# EasyEDA Pro project uP_Prelab.eprj

# Schematic Week1
Board Name: Board1; Create Date: 2025-12-17; Page Name: P1; Project Name: uP_Prelab; Schematic Name: Schematic1; Update Date: 2025-12-17; Company: EasyEDA.com; Page Size: A4; Version: V1.0
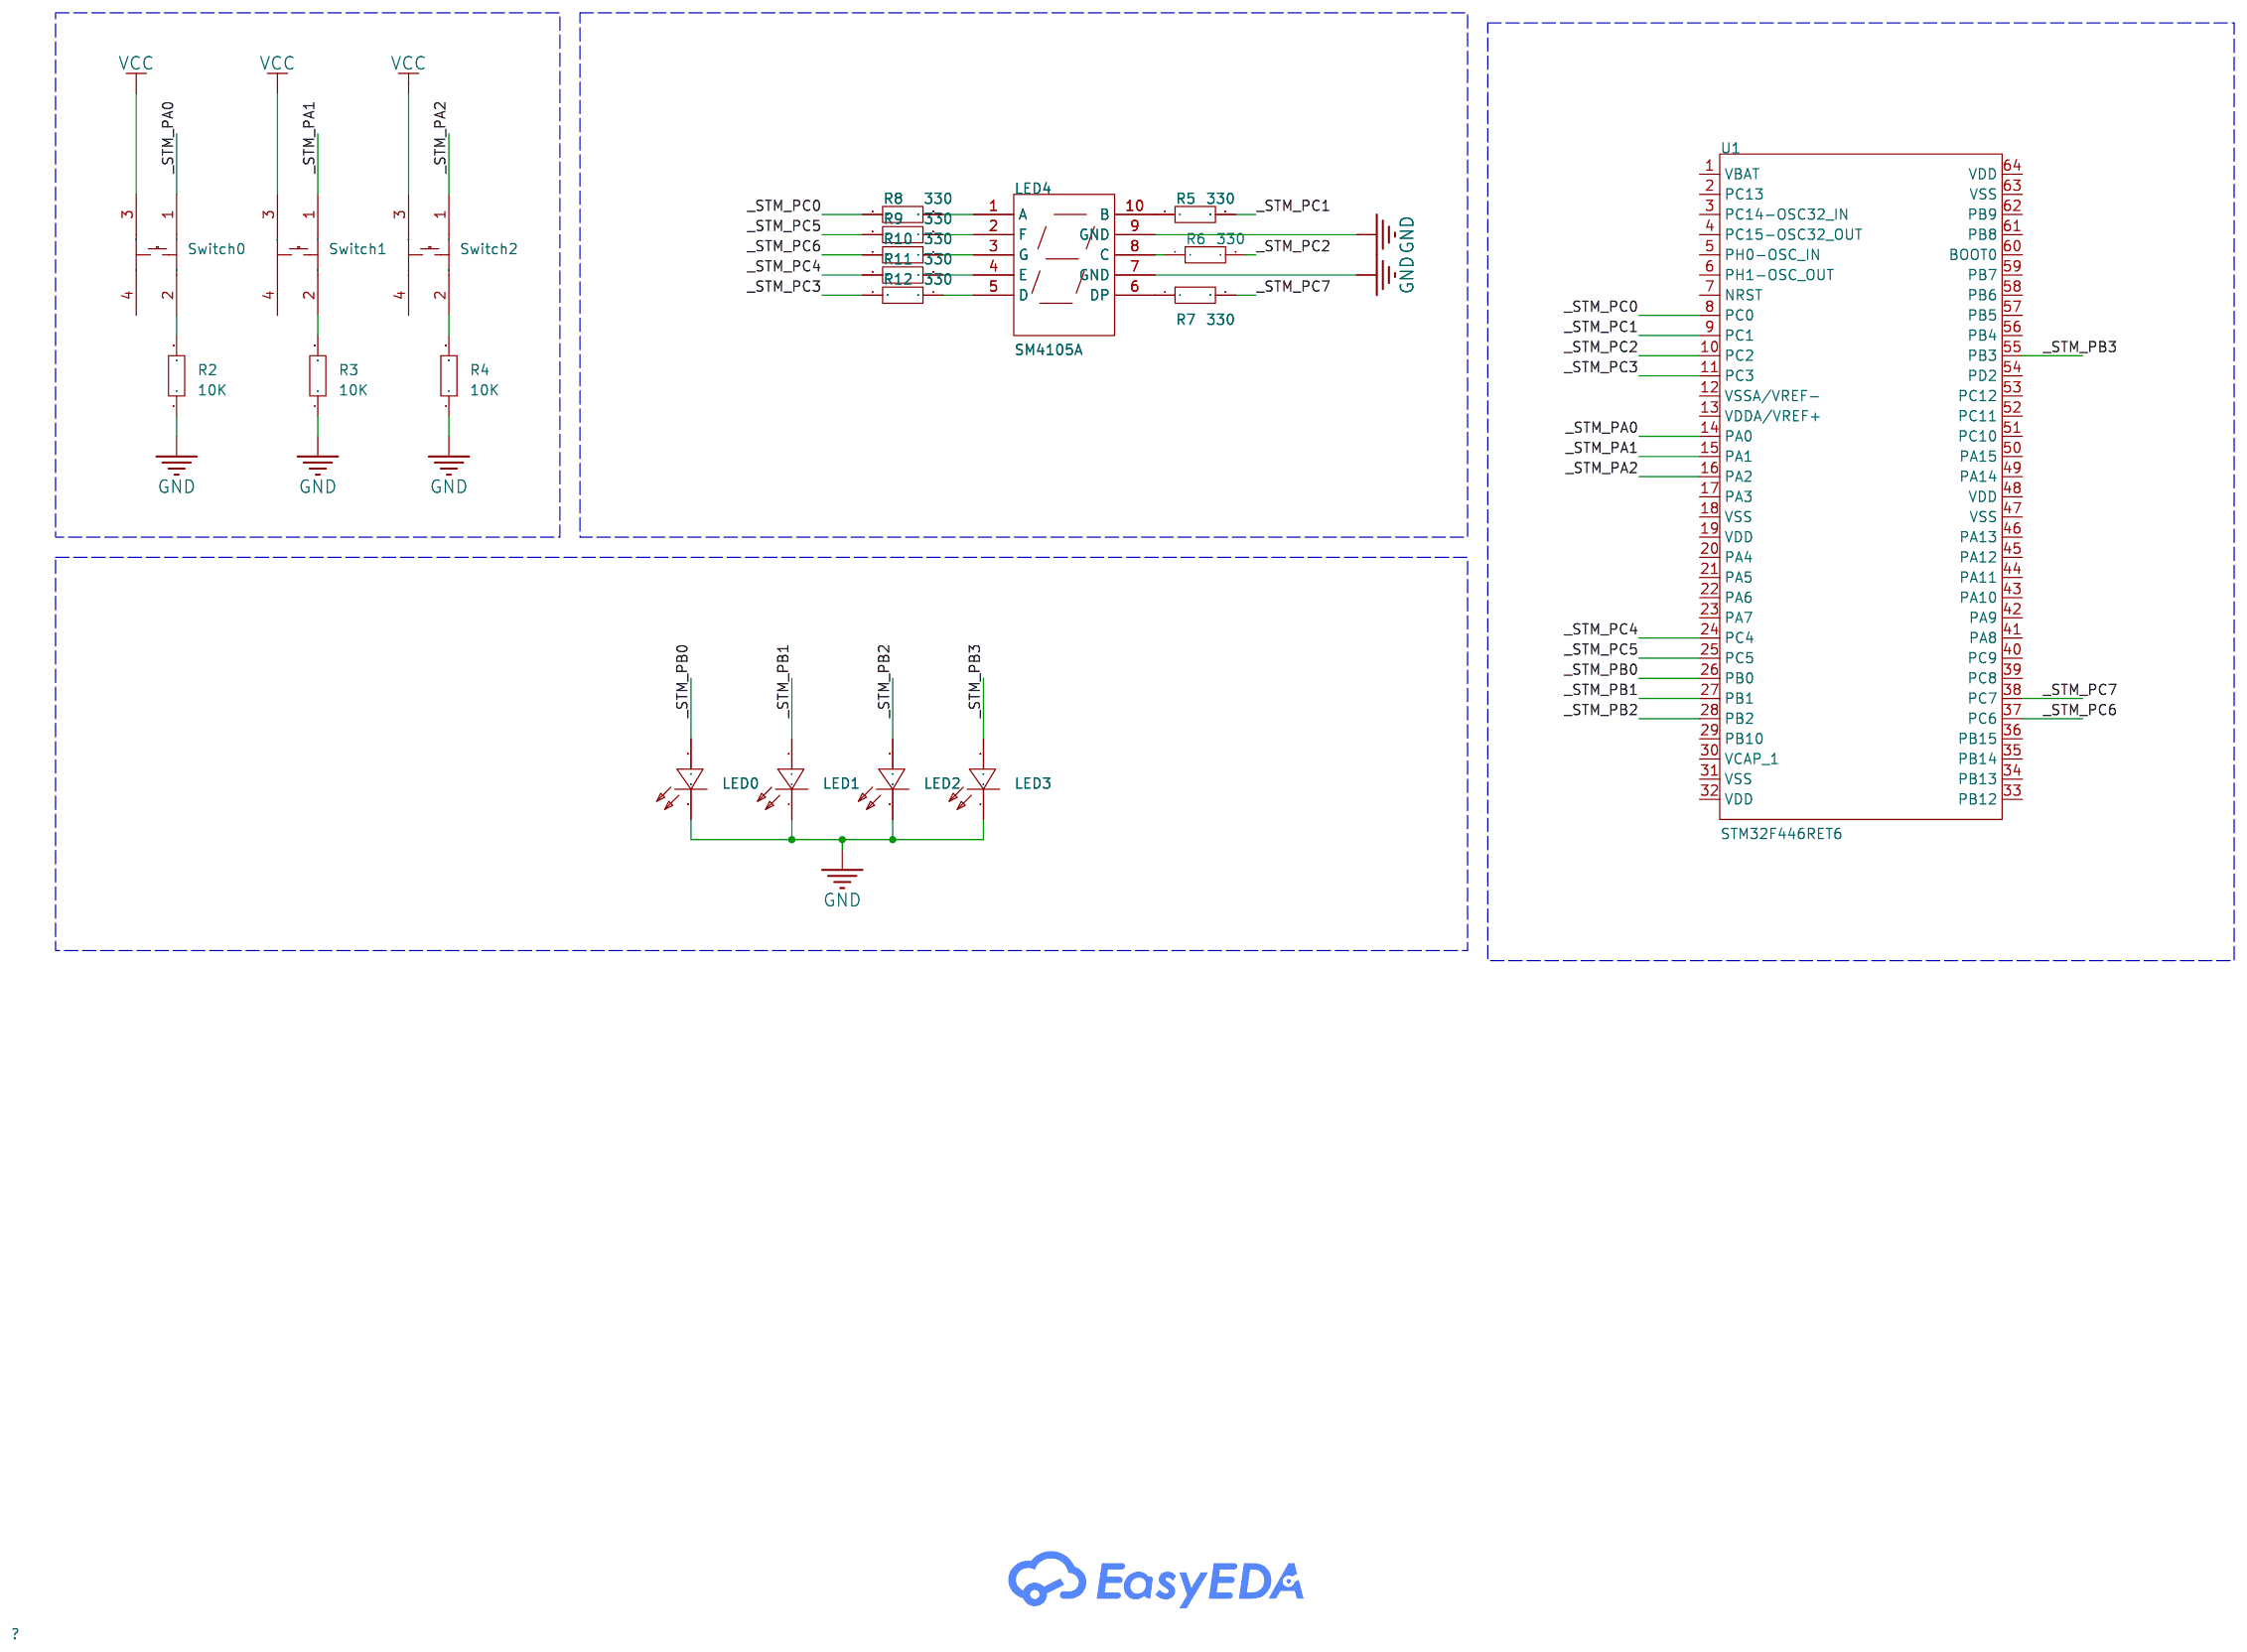
[diagram p0: schematic sheet]

## Parts
LED0  KT-0603R  [LED0603-RD]
LED1  KT-0603R  [LED0603-RD]
LED2  KT-0603R  [LED0603-RD]
LED3  KT-0603R  [LED0603-RD]
LED4  SM4105A  [LED-SEG-TH_10P-L19.0-W12.6-P2.54-S15.24-BL]
R2  10K  [R0603]
R3  10K  [R0603]
R4  10K  [R0603]
R5  330  [R0603]
R6  330  [R0603]
R7  330  [R0603]
R8  330  [R0603]
R9  330  [R0603]
R10  330  [R0603]
R11  330  [R0603]
R12  330  [R0603]
Switch0  4脚2位按钮(6mm)  [KEY-TH_4P-L6.0-W6.0-P4.5-LS6.5-TL]
Switch1  4脚2位按钮(6mm)  [KEY-TH_4P-L6.0-W6.0-P4.5-LS6.5-TL]
Switch2  4脚2位按钮(6mm)  [KEY-TH_4P-L6.0-W6.0-P4.5-LS6.5-TL]
U1  STM32F446RET6  [LQFP-64_L10.0-W10.0-P0.50-LS12.0-BL]

## Library data of the parts
LED0-LED3 = KT-0603R: Emitted Color:Red Power Dissipation:- Forward Current:- Dominant Wavelength:- Dominant Wavelength:- Peak Wavelength:- Diode Configuration:- Lens Color:- Color Temperature:- Color Temperature:- Viewing Angle:- Mounting Sytle:- Operating Temperature:-40℃~+8; LCSC Part Name: 0603 红灯 高亮; Supplier Part: C2286; Manufacturer: KENTO; Supplier Footprint: 0603; JLCPCB Part Class: Basic Part; Datasheet: https://atta.szlcsc.com/upload/public/pdf/source/20160616/1466072038404.pdf; Supplier: LCSC; Emitted Color: Red; Operating Temperature: -40℃~+85℃
LED4 = SM4105A: Supplier Part: C9900021777; Supplier Footprint: LED-SEG-TH; JLCPCB Part Class: Extended Part; Supplier: LCSC
R2-R12 = Res_0603: Supplier Footprint: 0603
Switch0-Switch2 = 4脚2位按钮(6mm): Supplier Part: C9900010456; Supplier Footprint: 插件; JLCPCB Part Class: Extended Part; Supplier: LCSC
U1 = STM32F446RET6: LCSC Part Name: MSL=3 带DSP和FPU的高性能基础系列ARM Cortex-M4 MCU，具有512 KB Flash、180 MHz CPU、ART加速器和双QSPI; Supplier Part: C69336; Manufacturer: ST(意法半导体); Supplier Footprint: LQFP-64(10x10); JLCPCB Part Class: Extended Part; Datasheet: https://item.szlcsc.com/datasheet/STM32F446RET6/70451.html; Supplier: LCSC; CPU Core: ARM-M4; CPU Maximum Speed: 180MHz; CPU Bit Width: 32bit; Program Storage Size: 512KB; Program Memory Type: FLASH; Number of I/O: 50; ADC (Bit): 12bit; DAC (Bit): 12bit; Voltage - Supply: 1.7V~3.6V

## Nets
GND: LED0.1(K) LED1.1(K) LED2.1(K) LED3.1(K) LED4.7(GND) LED4.9(GND) R2.1 R3.1 R4.1
VCC: Switch0.3 Switch1.3 Switch2.3
_STM_PA0: Switch0.1 U1.14(PA0)
_STM_PA1: Switch1.1 U1.15(PA1)
_STM_PA2: Switch2.1 U1.16(PA2)
_STM_PB0: LED0.2(A) U1.26(PB0)
_STM_PB1: LED1.2(A) U1.27(PB1)
_STM_PB2: LED2.2(A) U1.28(PB2)
_STM_PB3: LED3.2(A) U1.55(PB3)
_STM_PC0: R8.1 U1.8(PC0)
_STM_PC1: R5.2 U1.9(PC1)
_STM_PC2: R6.2 U1.10(PC2)
_STM_PC3: R12.1 U1.11(PC3)
_STM_PC4: R11.1 U1.24(PC4)
_STM_PC5: R9.1 U1.25(PC5)
_STM_PC6: R10.1 U1.37(PC6)
_STM_PC7: R7.2 U1.38(PC7)
Net-(LED4-1): LED4.1(A) R8.2
Net-(LED4-2): LED4.2(F) R9.2
Net-(LED4-3): LED4.3(G) R10.2
Net-(LED4-4): LED4.4(E) R11.2
Net-(LED4-5): LED4.5(D) R12.2
Net-(LED4-6): LED4.6(DP) R7.1
Net-(LED4-8): LED4.8(C) R6.1
Net-(LED4-10): LED4.10(B) R5.1
Net-(R2-2): R2.2 Switch0.2
Net-(R3-2): R3.2 Switch1.2
Net-(R4-2): R4.2 Switch2.2

Not connected (* = marked no-connect by the designer): Switch0 4; Switch1 4; Switch2 4; U1 1(VBAT) 2(PC13) 3(PC14-OSC32_IN) 4(PC15-OSC32_OUT) 5(PH0-OSC_IN) 6(PH1-OSC_OUT) 7(NRST) 12(VSSA/VREF-) 13(VDDA/VREF+) 17(PA3) 18(VSS) 19(VDD) 20(PA4) 21(PA5) 22(PA6) 23(PA7) 29(PB10) 30(VCAP_1) 31(VSS) 32(VDD) 33(PB12) 34(PB13) 35(PB14) 36(PB15) 39(PC8) 40(PC9) 41(PA8) 42(PA9) 43(PA10) 44(PA11) 45(PA12) 46(PA13) 47(VSS) 48(VDD) 49(PA14) 50(PA15) 51(PC10) 52(PC11) 53(PC12) 54(PD2) 56(PB4) 57(PB5) 58(PB6) 59(PB7) 60(BOOT0) 61(PB8) 62(PB9) 63(VSS) 64(VDD)
